# EAGLE schematic PCB_Gabri1.1.1 (EAGLE 8.6.3)
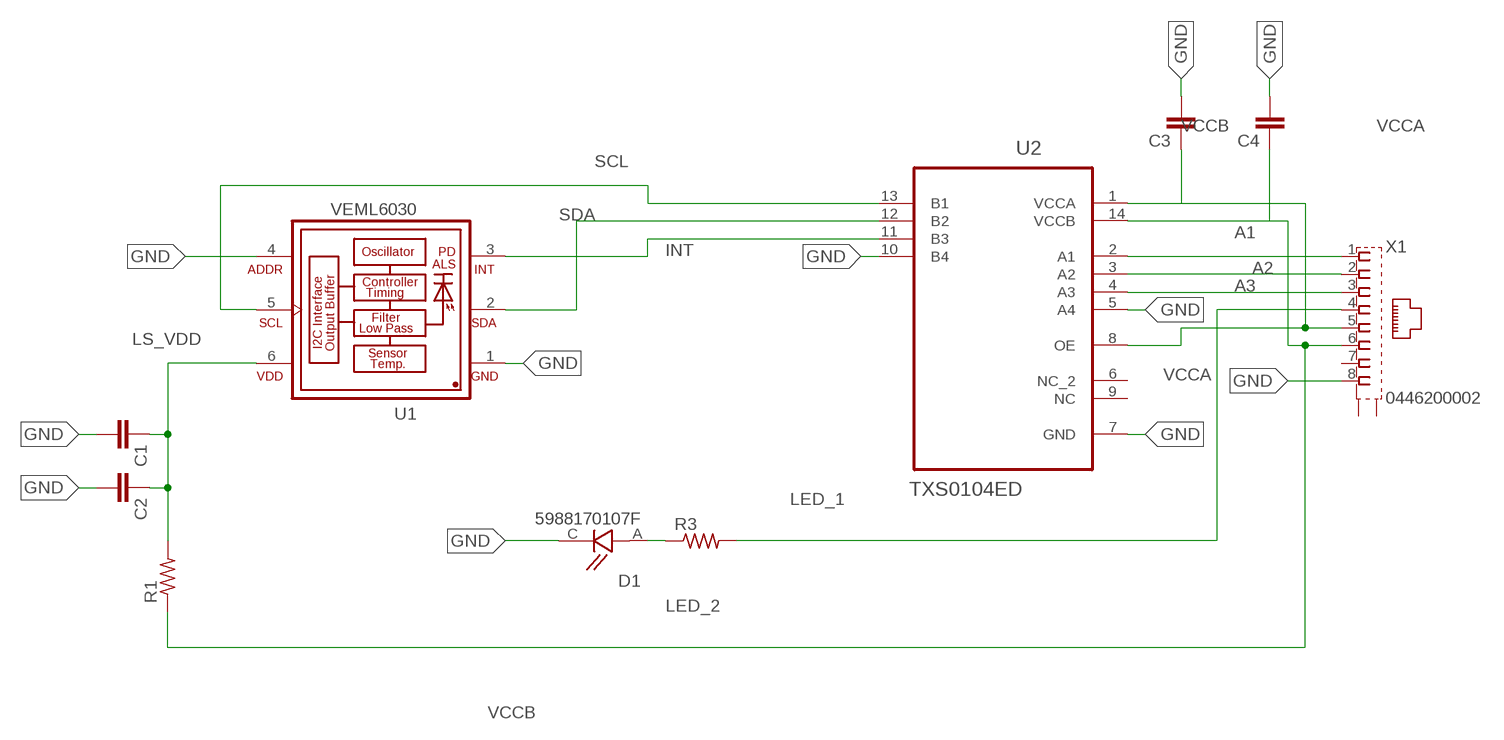
[diagram p0: schematic, sheet 1]

## Parts
C1  C-EU025-024X044  [C025-024X044]
C2  C-EU025-024X044  [C025-024X044]
C3  C-EU025-024X044  [C025-024X044]
C4  C-EU025-024X044  [C025-024X044]
D1  5988170107F  [LEDC2012X70N]
R1  R-US_R0805  [R0805]
R3  R-US_R0805  [R0805]
U1  VEML6030  [VISHAY_VEML6030_2X2X0.87]
U2  TXS0104ED  [SOIC127P600X175-14N]
X1  0446200002  [0446200002]

## Nets
A1: U2.2(A1) X1.1
A2: U2.3(A2) X1.2
A3: U2.4(A3) X1.3
GND: C1.2 C2.2 C3.2 C4.2 D1.C U1.1(GND) U1.4(ADDR) U2.5(A4) U2.7(GND) U2.10(B4) X1.8
INT: U1.3(INT) U2.11(B3)
LED_1: R3.2 X1.4
LED_2: D1.A R3.1
LS_VDD: C1.1 C2.1 R1.2 U1.6(VDD)
SCL: U1.5(SCL) U2.13(B1)
SDA: U1.2(SDA) U2.12(B2)
VCCA: C3.1 U2.1(VCCA) U2.8(OE) X1.5
VCCB: C4.1 R1.1 U2.14(VCCB) X1.6
Unconnected: U2.6(NC_2) U2.9(NC) X1.7 X1.S@1(S1) X1.S@2(S2)

## Library data of the parts
C1-C4 = resistor:C-EU: CAPACITOR, European symbol
D1 = 5988170107F:5988170107F: Standard LEDs - SMD Green Water Clr 40mcd 570nm; AVAILABILITY: Unavailable; DESCRIPTION: LED GREEN CLEAR 0805 SMD; MF: Dialight; MP: 5988170107F; PACKAGE: 0805 Dialight; PRICE: None
R1 R3 = resistor:R-US_: RESISTOR, American symbol
U1 = VEML6030:VEML6030: VEML6030 High Accuracy Ambient Light Sensor with I2C Interface: VEML6030 is a high accuracy ambient light digital 16-bit resolution sensor in a miniature transparent 2 mm x 2 mm package. It includes a high sensitive photodiode, a low noise amplifier, a 16-bit A/D converter and supports an easy to use I2C bus communication interface and additional interrupt feature. The ambient light result is as digital value available. Device Model created 15.06.2016 by Johannes Kolb - Vishay Semiconductor GmbH; AVAILABILITY: Unavailable; DESCRIPTION: VEML6030 Series 2 x 2 x 0.85 mm 50 mW I2C High Accuracy Ambient Light Sensor; MF: Vishay; MP: VEML6030; PACKAGE: SMD-6 Vishay; PRICE: None
U2 = TXS0104ED:TXS0104ED: 4-BIT BIDIRECTIONAL VOLTAGE-LEVEL TRANSLATOR FOR OPEN-DRAIN AND PUSH-PULL APPLICATIONS; AVAILABILITY: Unavailable; DESCRIPTION: 4-Bit Bidirectional Voltage-Level Shifter for Open-Drain and Push-Pull Applications 14-SOIC -40 to 85; MF: Texas Instruments; MP: TXS0104ED; PACKAGE: SOIC-14 Texas Instruments; PRICE: None
X1 = 0446200002:0446200002: RJ-45 INVERTED MODULAR JACK ASSEMBLY WITH RJ-11 KEEPOUT FEATURE Source: Data sheet <http://www.farnell.com/datasheets/73207.pdf> MOLEX 0446200002 BUCHSE, RJ45, GESCHIRMT Source: Farnell <http://de.farnell.com/molex/0446200002/buchse-rj45-geschirmt/dp/9251910?ost=9251910>; AVAILABILITY: Unavailable; DESCRIPTION: Conn RJ-45 RCP 8 POS 2.04mm Solder RA Thru-Hole 8 Terminal 1 Port Tray Cat 3; MF: Molex, LLC; MP: 0446200002; PACKAGE: None; PRICE: None